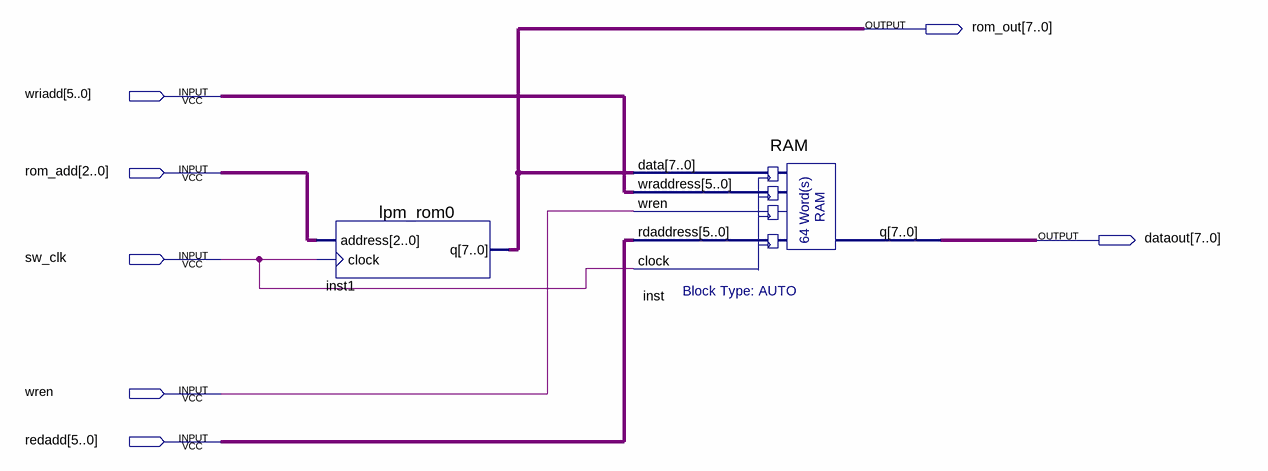
[diagram p0: schematic sheet]
// Quartus schematic ROM_RAM.bdf as structural Verilog: 2 symbols, 7 pins
module ROM_RAM (
  input  [5:0] wriadd,
  input  [2:0] rom_add,
  input  sw_clk,
  input  wren,
  input  [5:0] redadd,
  output [7:0] rom_out,
  output [7:0] dataout
);

  lpm_rom0 inst1 (.address(rom_add), .clock(sw_clk), .q(rom_out));
  RAM inst (.data(rom_out), .wraddress(wriadd), .wren(wren), .rdaddress(redadd), .clock(sw_clk), .q(dataout));
endmodule
